# EAGLE schematic DualSVF (EAGLE 7.5.0)
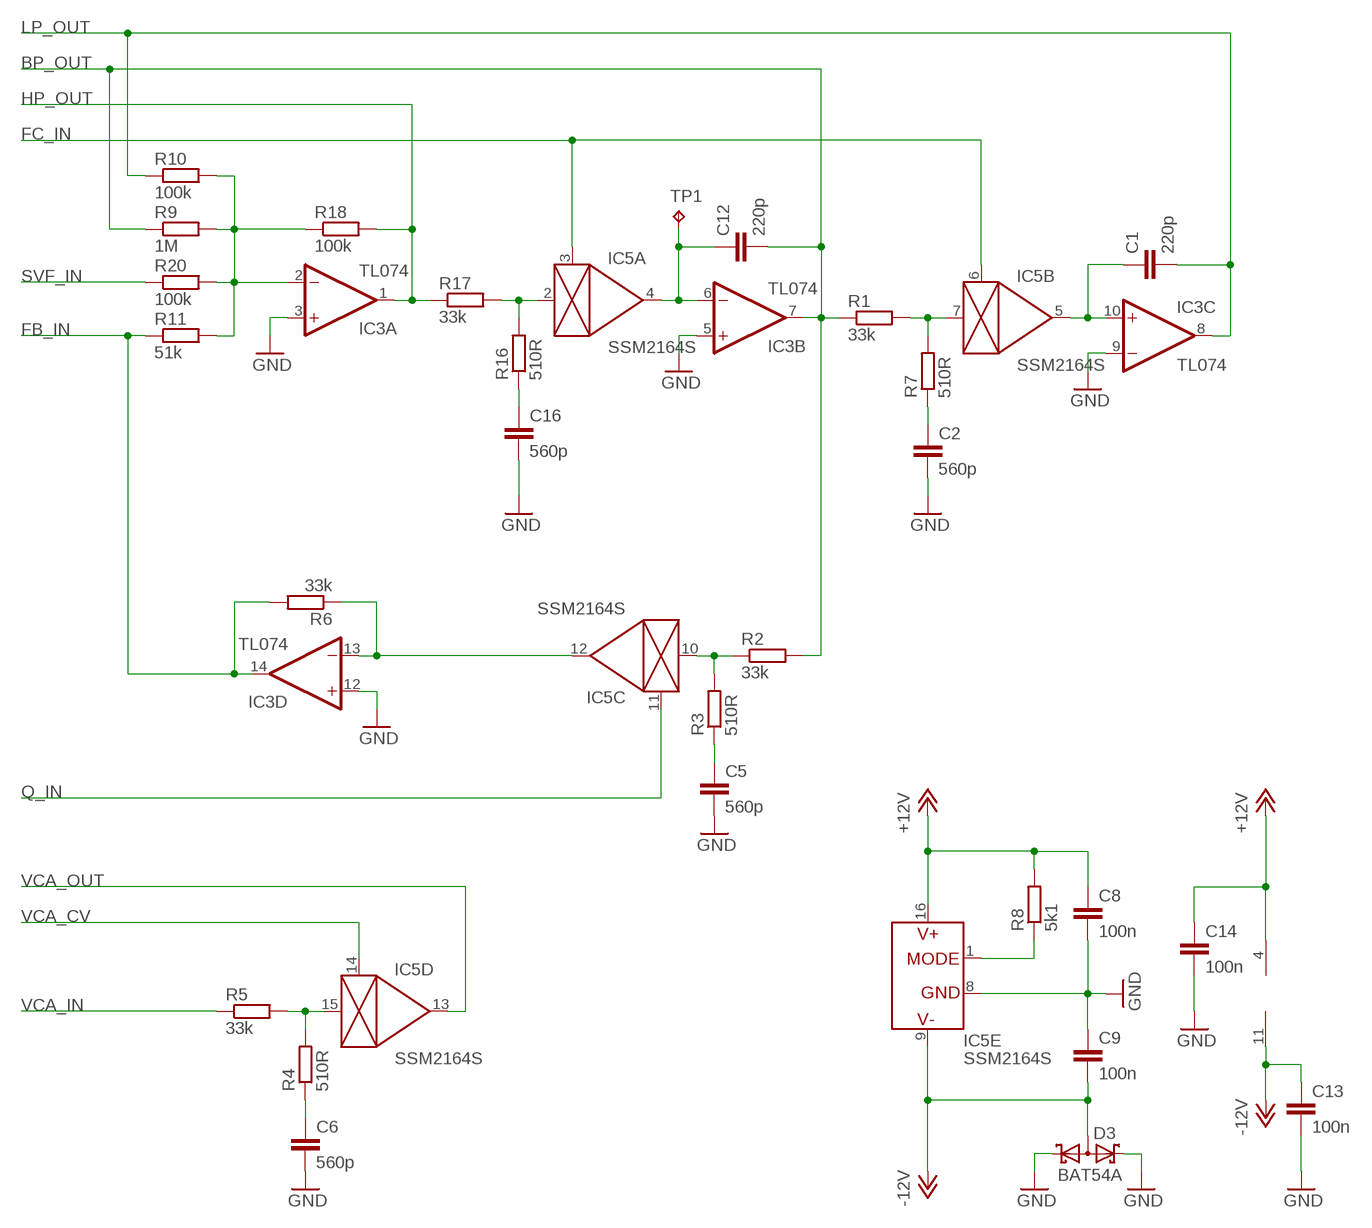
[diagram p0: schematic, sheet 1]

## Parts
C1  220p  C-EUC0603  [C0603]
C2  560p  C-EUC0603  [C0603]
C5  560p  C-EUC0603  [C0603]
C6  560p  C-EUC0603  [C0603]
C8  100n  C-EUC0603K  [C0603K]
C9  100n  C-EUC0603K  [C0603K]
C12  220p  C-EUC0603  [C0603]
C13  100n  C-EUC0603K  [C0603K]
C14  100n  C-EUC0603K  [C0603K]
C16  560p  C-EUC0603  [C0603]
D3  BAT54A  [SOT23]
IC3  TL074  TL074D  [SO14]
IC5  SSM2164S  [SOIC16N]
R1  33k  R-EU_0603  [0603]
R2  33k  R-EU_0603  [0603]
R3  510R  R-EU_0603  [0603]
R4  510R  R-EU_0603  [0603]
R5  33k  R-EU_0603  [0603]
R6  33k  R-EU_0603  [0603]
R7  510R  R-EU_0603  [0603]
R8  5k1  R-EU_0603  [0603]
R9  1M  R-EU_0603  [0603]
R10  100k  R-EU_0603  [0603]
R11  51k  R-EU_0603  [0603]
R16  510R  R-EU_0603  [0603]
R17  33k  R-EU_0603  [0603]
R18  100k  R-EU_0603  [0603]
R20  100k  R-EU_0603  [0603]
TP1  TPPAD1-13  [P1-13]

## Nets
+12V: C8.1 C14.1 IC3.4(P:V+) IC5.16(E:V+) R8.2
-12V: C9.2 C13.1 D3.3(AA) IC3.11(P:V-) IC5.9(E:V-)
BP_OUT: C12.2 IC3.7(B:OUT) R1.1 R2.2 R9.1
FB_IN: IC3.14(D:OUT) R6.2 R11.1
FC_IN: IC5.3(A:CTRL) IC5.6(B:CTRL)
GND: C2.2 C5.2 C6.2 C8.2 C9.1 C13.2 C14.2 C16.2 D3.1(K1) D3.2(K2) IC3.3(A:+IN) IC3.5(B:+IN) IC3.9(C:-IN) IC3.12(D:+IN) IC5.8(E:GND)
HP_OUT: IC3.1(A:OUT) R17.1 R18.2
LP_OUT: C1.2 IC3.8(C:OUT) R10.1
N$1: IC5.1(E:MODE) R8.1
N$2: IC5.7(B:IN) R1.2 R7.2
N$4: C2.1 R7.1
N$5: C1.1 IC3.10(C:+IN) IC5.5(B:OUT)
N$8: IC3.13(D:-IN) IC5.12(C:OUT) R6.1
N$12: IC3.2(A:-IN) R9.2 R10.2 R11.2 R18.1 R20.2
N$17: C6.1 R4.1
N$19: C12.1 IC3.6(B:-IN) IC5.4(A:OUT) TP1.TP
N$21: IC5.10(C:IN) R2.1 R3.2
N$26: IC5.15(D:IN) R4.2 R5.2
N$27: C5.1 R3.1
N$29: IC5.2(A:IN) R16.2 R17.2
N$30: C16.1 R16.1
Q_IN: IC5.11(C:CTRL)
SVF_IN: R20.1
VCA_CV: IC5.14(D:CTRL)
VCA_IN: R5.1
VCA_OUT: IC5.13(D:OUT)

## Library data of the parts
C1 C2 C5 C6 C8 C9 C12-C14 C16 = Rebel:C-EU: CAPACITOR, European symbol
D3 = diode:BAT54A: Schottky Diodes Source: Fairchild .. BAT54.pdf
IC3 = linear:TL074: OP AMP
IC5 = ssm2164:SSM2164
R1-R11 R16-R18 R20 = Rebel:R-EU_: RESISTOR, European symbol
TP1 = testpad:TP: Test pad